# Altium schematic sheet TLE6244x.SchDoc
size A4; SheetNumber: 4; SheetTotal: 8
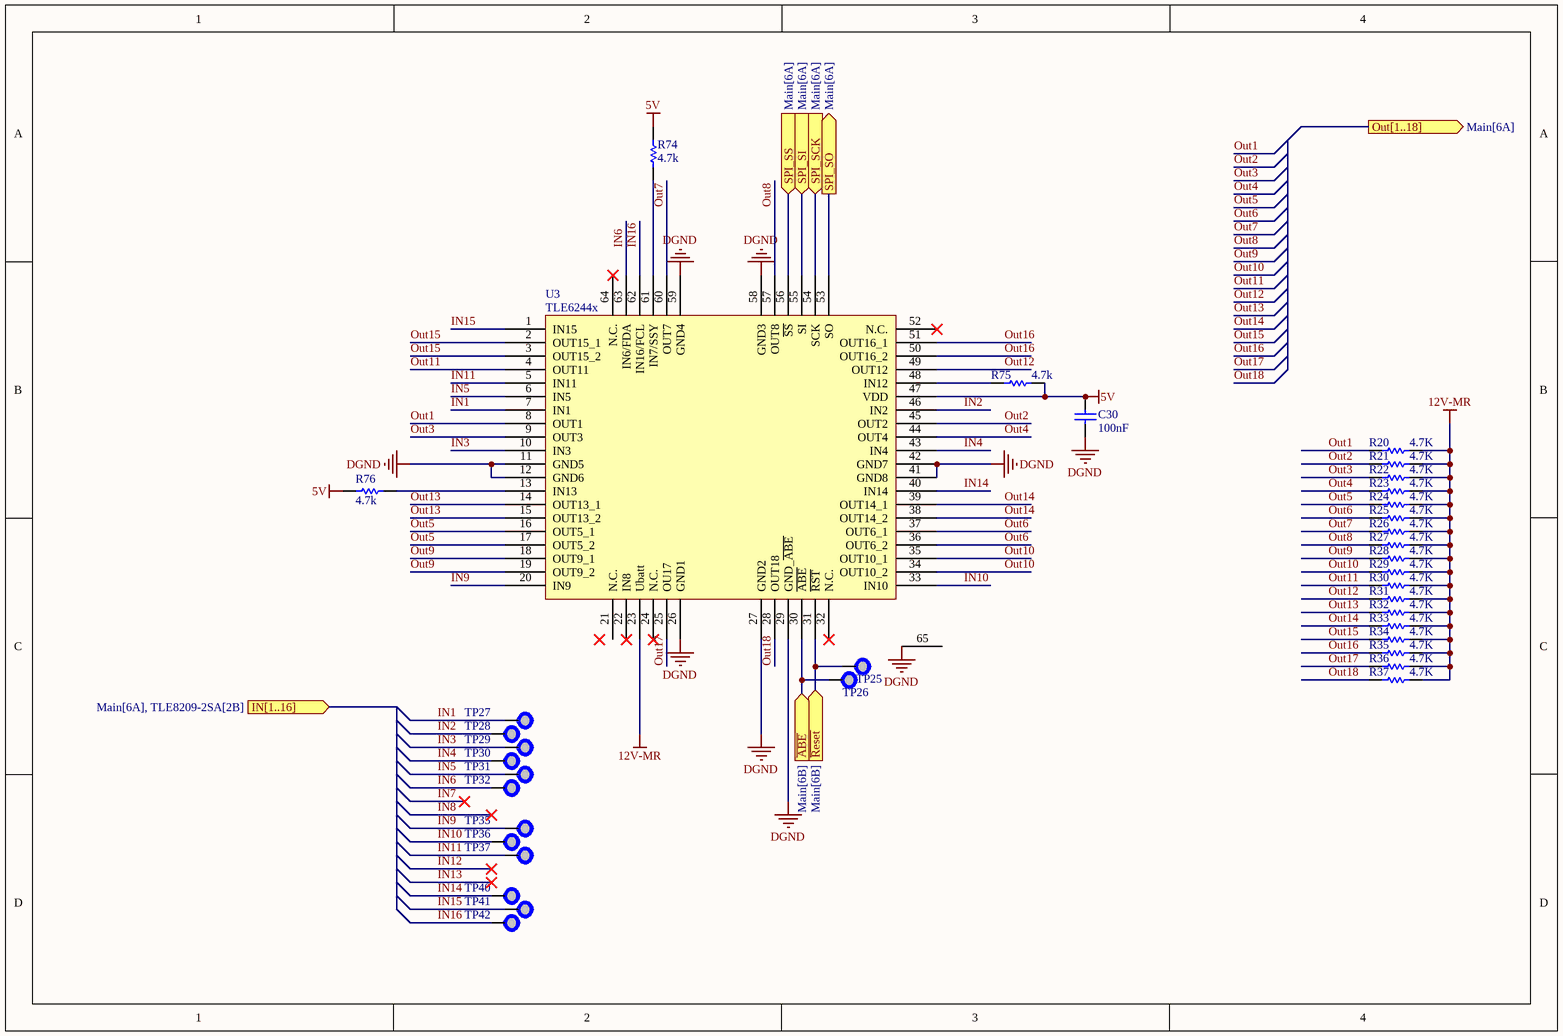
[diagram p0: TLE6244x.SchDoc]

## Parts
C30  100nF  [0603c]
R20  4.7K  [0805]
R21  4.7K  [0805]
R22  4.7K  [0805]
R23  4.7K  [0805]
R24  4.7K  [0805]
R25  4.7K  [0805]
R26  4.7K  [0805]
R27  4.7K  [0805]
R28  4.7K  [0805]
R29  4.7K  [0805]
R30  4.7K  [0805]
R31  4.7K  [0805]
R32  4.7K  [0805]
R33  4.7K  [0805]
R34  4.7K  [0805]
R35  4.7K  [0805]
R36  4.7K  [0805]
R37  4.7K  [0805]
R74  4.7K  [0805]
R75  4.7K  [0805]
R76  4.7K  [0805]
TP25  TestPoint  [TP]  (value not drawn)
TP26  TestPoint  [TP]  (value not drawn)
TP27  TestPoint  [TP]  (value not drawn)
TP28  TestPoint  [TP]  (value not drawn)
TP29  TestPoint  [TP]  (value not drawn)
TP30  TestPoint  [TP]  (value not drawn)
TP31  TestPoint  [TP]  (value not drawn)
TP32  TestPoint  [TP]  (value not drawn)
TP35  TestPoint  [TP]  (value not drawn)
TP36  TestPoint  [TP]  (value not drawn)
TP37  TestPoint  [TP]  (value not drawn)
TP40  TestPoint  [TP]  (value not drawn)
TP41  TestPoint  [TP]  (value not drawn)
TP42  TestPoint  [TP]  (value not drawn)
U3  TLE6244x  [TLE6244]

## Ports
IN[1..16] (in, see Main[6A], TLE8209-2SA[2B]), Out[1..18] (out, see Main[6A]), SPI_SCK (in, see Main[6A]), SPI_SI (in, see Main[6A]), SPI_SO (out, see Main[6A]), SPI_SS (in, see Main[6A]), ~{ABE} (in, see Main[6B]), ~{Reset} (in, see Main[6B])

## Nets
5V: C30.1 R74.2 R75.1 R76.2 U3.47(VDD)
12V-MR: R20.1 R21.1 R22.1 R23.1 R24.1 R25.1 R26.1 R27.1 R28.1 R29.1 R30.1 R31.1 R32.1 R33.1 R34.1 R35.1 R36.1 R37.1 U3.23(Ubatt)
DGND: C30.2 U3.11(GND5) U3.12(GND6) U3.26(GND1) U3.27(GND2) U3.29(GND_~{ABE}) U3.41(GND8) U3.42(GND7) U3.58(GND3) U3.59(GND4) U3.65(DGND)
~{ABE}: TP26.1 U3.30(~{ABE}) ; port ~{ABE}
IN1: TP27.1 U3.7(IN1)
IN2: TP28.1 U3.46(IN2)
IN3: TP29.1 U3.10(IN3)
IN4: TP30.1 U3.43(IN4)
IN5: TP31.1 U3.6(IN5)
IN6: TP32.1 U3.63(IN6/FDA)
IN9: TP35.1 U3.20(IN9)
IN10: TP36.1 U3.33(IN10)
IN11: TP37.1 U3.5(IN11)
IN14: TP40.1 U3.40(IN14)
IN15: TP41.1 U3.1(IN15)
IN16: TP42.1 U3.62(IN16/FCL)
Out1: R20.2 U3.8(OUT1)
Out2: R21.2 U3.45(OUT2)
Out3: R22.2 U3.9(OUT3)
Out4: R23.2 U3.44(OUT4)
Out5: R24.2 U3.16(OUT5_1) U3.17(OUT5_2)
Out6: R25.2 U3.36(OUT6_2) U3.37(OUT6_1)
Out7: R26.2 U3.60(OUT7)
Out8: R27.2 U3.57(OUT8)
Out9: R28.2 U3.18(OUT9_1) U3.19(OUT9_2)
Out10: R29.2 U3.34(OUT10_2) U3.35(OUT10_1)
Out11: R30.2 U3.4(OUT11)
Out12: R31.2 U3.49(OUT12)
Out13: R32.2 U3.14(OUT13_1) U3.15(OUT13_2)
Out14: R33.2 U3.38(OUT14_2) U3.39(OUT14_1)
Out15: R34.2 U3.2(OUT15_1) U3.3(OUT15_2)
Out16: R35.2 U3.50(OUT16_2) U3.51(OUT16_1)
Out17: R36.2 U3.25(OU17)
Out18: R37.2 U3.28(OUT18)
~{Reset}: TP25.1 U3.31(~{RST}) ; port ~{Reset}
SPI_SCK: U3.54(SCK) ; port SPI_SCK
SPI_SI: U3.55(SI) ; port SPI_SI
SPI_SO: U3.53(SO) ; port SPI_SO
SPI_SS: U3.56(~{SS}) ; port SPI_SS
NetR74_1: R74.1 U3.61(IN7/SSY)
NetR75_2: R75.2 U3.48(IN12)
NetR76_1: R76.1 U3.13(IN13)

Not connected (* = marked no-connect by the designer): U3 21(N.C.) 22(IN8)* 24(N.C.)* 32(N.C.)* 52(N.C.)* 64(N.C.)*

## Library data of the parts
C30 = Cap: LOW ESR; Published: 8-Jun-2000; LatestRevisionDate: 17-Jul-2002; LatestRevisionNote: Re-released for DXP Platform.; PackageReference: RAD-0.3; Publisher: Altium Limited; PackageDescription: Radial Cap, Thru-Hole; 2 Leads; 0.3 in Pin Spacing; Value: 100nF
R20-R37 R74-R76 = Res1: Resistor; Published: 8-Jun-2000; LatestRevisionDate: 17-Jul-2002; LatestRevisionNote: Re-released for DXP Platform.; PackageReference: AXIAL-0.3; Publisher: Altium Limited; PackageDescription: Axial Device, Thru-Hole; 2 Leads; 0.3 in Pin Spacing
  R20-R37: Value: 4.7K
  R74-R76: Value: 4.7k
U3 = TLE6244x: PG-MQFP-64-10; Manufacturer: Infineon; Code: 12; Priority: 1; Package: PG-MQFP-64-10; Part Number: TLE6244X; Type: 18 Channel Smart Lowside Switch; Features: AEC Qualified